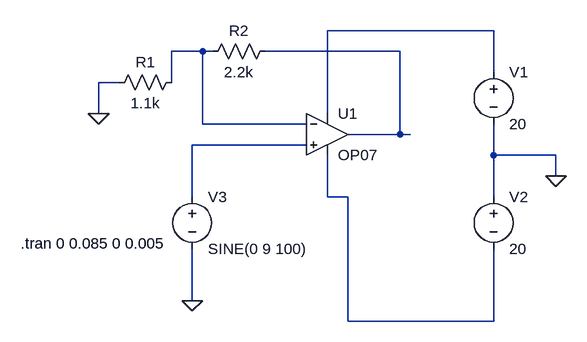
[diagram p0: schematic Non inv op-amp.asc]
Non inv op-amp.asc, the LTspice schematic file:
Version 4
SHEET 1 880 680
WIRE 416 0 160 0
WIRE -32 32 -80 32
WIRE -16 32 -32 32
WIRE 272 32 64 32
WIRE 416 64 416 0
WIRE -160 80 -192 80
WIRE -80 80 -80 32
WIRE -192 128 -192 80
WIRE 160 128 160 0
WIRE -32 144 -32 32
WIRE 128 144 -32 144
WIRE 272 160 272 32
WIRE 272 160 192 160
WIRE 288 160 272 160
WIRE 128 176 -48 176
WIRE 416 192 416 144
WIRE 512 192 416 192
WIRE 512 224 512 192
WIRE -48 256 -48 176
WIRE 160 256 160 192
WIRE 192 256 160 256
WIRE 416 256 416 192
WIRE -48 416 -48 336
WIRE 192 448 192 256
WIRE 416 448 416 336
WIRE 416 448 192 448
FLAG 512 224 0
FLAG -192 128 0
FLAG -48 416 0
SYMBOL OpAmps\\OP07 160 96 R0
SYMATTR InstName U1
SYMBOL voltage 416 48 R0
WINDOW 123 0 0 Left 0
WINDOW 39 0 0 Left 0
SYMATTR InstName V1
SYMATTR Value 20
SYMBOL voltage 416 240 R0
WINDOW 123 0 0 Left 0
WINDOW 39 0 0 Left 0
SYMATTR InstName V2
SYMATTR Value 20
SYMBOL voltage -48 240 R0
WINDOW 123 0 0 Left 0
WINDOW 39 0 0 Left 0
SYMATTR InstName V3
SYMATTR Value SINE(0 9 100)
SYMBOL res -64 64 R90
WINDOW 0 0 56 VBottom 2
WINDOW 3 32 56 VTop 2
SYMATTR InstName R1
SYMATTR Value 1.1k
SYMBOL res 80 16 R90
WINDOW 0 0 56 VBottom 2
WINDOW 3 32 56 VTop 2
SYMATTR InstName R2
SYMATTR Value 2.2k
TEXT -312 328 Left 2 !.tran 0 0.085 0 0.005

The netlist it stands for:
* Non inv op-amp.asc
XU1 N004 N002 N001 N005 N003 LT1001  ; OP07, pins In+ In- V+ V- OUT
V1 N001 0 20
V2 0 N005 20
V3 N004 0 SINE(0 9 100)
R1 N002 0 1.1k
R2 N003 N002 2.2k
.tran 0 0.085 0 0.005
.lib LTC.lib
.backanno
.end